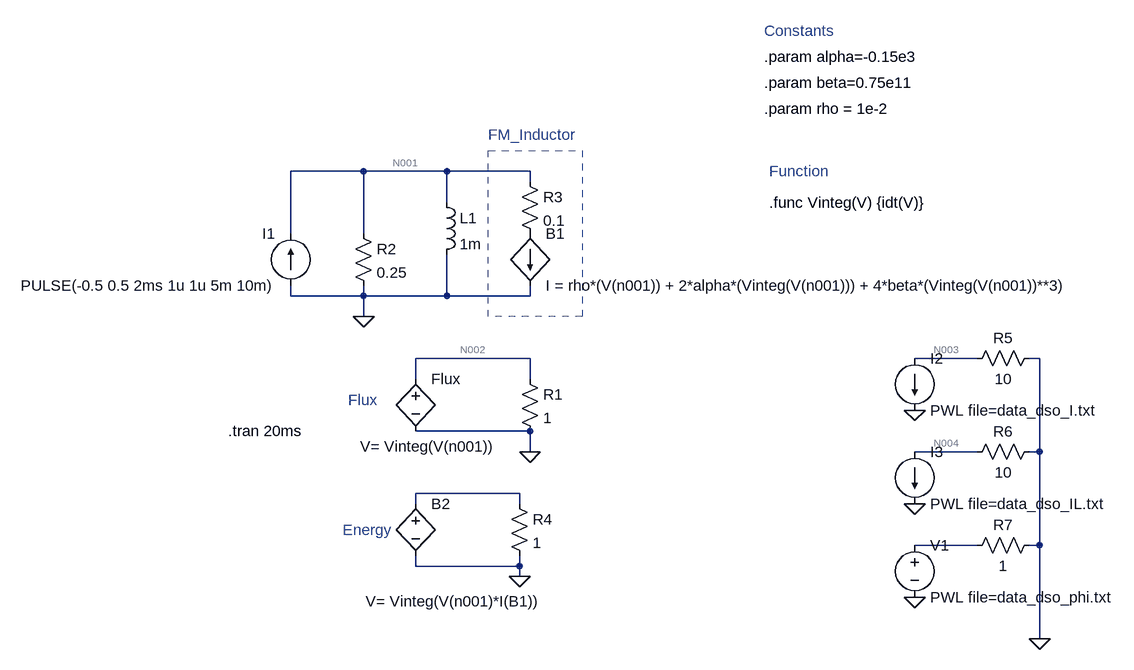
[diagram p0: schematic ferromag_ind_pos_ind.asc]
ferromag_ind_pos_ind.asc, the LTspice schematic file:
Version 4
SHEET 1 1992 692
WIRE 176 -48 64 -48
WIRE 304 -48 176 -48
WIRE 432 -48 304 -48
WIRE 432 -32 432 -48
WIRE 304 0 304 -48
WIRE 64 48 64 -48
WIRE 176 48 176 -48
WIRE 64 144 64 128
WIRE 176 144 176 128
WIRE 176 144 64 144
WIRE 304 144 304 80
WIRE 304 144 176 144
WIRE 432 144 432 128
WIRE 432 144 304 144
WIRE 176 176 176 144
WIRE 432 240 256 240
WIRE 1120 240 1024 240
WIRE 1216 240 1200 240
WIRE 256 272 256 240
WIRE 432 272 432 240
WIRE 432 352 256 352
WIRE 432 384 432 352
WIRE 1120 384 1024 384
WIRE 1216 384 1216 240
WIRE 1216 384 1200 384
WIRE 416 448 256 448
WIRE 256 464 256 448
WIRE 416 464 416 448
WIRE 1120 528 1024 528
WIRE 1216 528 1216 384
WIRE 1216 528 1200 528
WIRE 256 560 256 544
WIRE 416 560 416 544
WIRE 416 560 256 560
WIRE 416 576 416 560
WIRE 1216 672 1216 528
FLAG 176 176 0
FLAG 432 384 0
FLAG 416 576 0
FLAG 1216 672 0
FLAG 1024 608 0
FLAG 1024 464 0
FLAG 1024 320 0
SYMBOL bi 432 48 R0
SYMATTR InstName B1
SYMATTR Value I = rho*(V(n001)) + 2*alpha*(Vinteg(V(n001))) + 4*beta*(Vinteg(V(n001))**3)
SYMBOL current 64 128 R180
WINDOW 0 24 80 Left 2
WINDOW 3 24 0 Left 2
WINDOW 123 0 0 Left 0
WINDOW 39 0 0 Left 0
SYMATTR InstName I1
SYMATTR Value PULSE(-0.5 0.5 2ms 1u 1u 5m 10m)
SYMBOL res 160 32 R0
SYMATTR InstName R2
SYMATTR Value 0.25
SYMBOL res 416 -48 R0
SYMATTR InstName R3
SYMATTR Value 0.1
SYMBOL bv 256 256 R0
WINDOW 3 -85 120 Left 2
SYMATTR Value V= Vinteg(V(n001))
SYMATTR InstName Flux
SYMBOL res 416 256 R0
SYMATTR InstName R1
SYMATTR Value 1
SYMBOL bv 256 448 R0
WINDOW 3 -77 166 Left 2
SYMATTR Value V= Vinteg(V(n001)*I(B1))
SYMATTR InstName B2
SYMBOL res 400 448 R0
SYMATTR InstName R4
SYMATTR Value 1
SYMBOL current 1024 240 R0
WINDOW 123 0 0 Left 0
WINDOW 39 0 0 Left 0
SYMATTR InstName I2
SYMATTR Value PWL file=data_dso_I.txt
SYMBOL current 1024 384 R0
WINDOW 123 0 0 Left 0
WINDOW 39 0 0 Left 0
SYMATTR InstName I3
SYMATTR Value PWL file=data_dso_IL.txt
SYMBOL voltage 1024 512 R0
WINDOW 123 0 0 Left 0
WINDOW 39 0 0 Left 0
SYMATTR InstName V1
SYMATTR Value PWL file=data_dso_phi.txt
SYMBOL res 1216 224 R90
WINDOW 0 0 56 VBottom 2
WINDOW 3 32 56 VTop 2
SYMATTR InstName R5
SYMATTR Value 10
SYMBOL res 1216 368 R90
WINDOW 0 0 56 VBottom 2
WINDOW 3 32 56 VTop 2
SYMATTR InstName R6
SYMATTR Value 10
SYMBOL res 1216 512 R90
WINDOW 0 0 56 VBottom 2
WINDOW 3 32 56 VTop 2
SYMATTR InstName R7
SYMATTR Value 1
SYMBOL ind 288 -16 R0
SYMATTR InstName L1
SYMATTR Value 1m
TEXT 792 -224 Left 2 !.param alpha=-0.15e3
TEXT 792 -184 Left 2 !.param beta=0.75e11
TEXT 792 -144 Left 2 !.param rho = 1e-2
TEXT 800 0 Left 2 !.func Vinteg(V) {idt(V)}
TEXT -32 352 Left 2 !.tran 20ms
TEXT 368 -104 Left 2 ;FM_Inductor
TEXT 792 -264 Left 2 ;Constants
TEXT 800 -48 Left 2 ;Function
TEXT 152 304 Left 2 ;Flux
TEXT 144 504 Left 2 ;Energy
RECTANGLE Normal 512 176 368 -80 2

The netlist it stands for:
* ferromag_ind_pos_ind.asc
B1 P001 0 I = rho*(V(n001)) + 2*alpha*(Vinteg(V(n001))) + 4*beta*(Vinteg(V(n001))**3)
I1 0 N001 PULSE(-0.5 0.5 2ms 1u 1u 5m 10m)
R2 N001 0 0.25
R3 N001 P001 0.1
B§Flux N002 0 V= Vinteg(V(n001))
R1 N002 0 1
B2 N005 0 V= Vinteg(V(n001)*I(B1))
R4 N005 0 1
I2 N003 0 PWL file=data_dso_I.txt
I3 N004 0 PWL file=data_dso_IL.txt
V1 N006 0 PWL file=data_dso_phi.txt
R5 0 N003 10
R6 0 N004 10
R7 0 N006 1
L1 N001 0 1m
.param alpha=-0.15e3
.param beta=0.75e11
.param rho = 1e-2
.func Vinteg(V) {idt(V)}
.tran 20ms
* FM_Inductor
* Constants
* Function
* Flux
* Energy
.backanno
.end

* Results of the author's LTspice run, read from the files saved beside the schematic
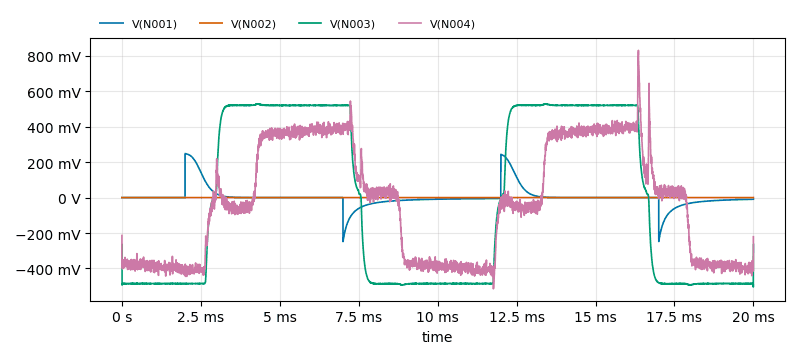
[diagram p1: Transient Analysis of ferromag_ind_pos_ind.asc, plotted from the saved traces]
* Transient Analysis, 1 run:
*   V(N001): min -248.8 mV, max 248.8 mV, average 1.469 mV, rms 58.17 mV, last -9.551 mV
*   V(N002): min -1.062 µV, max 144 µV, average 87.05 µV, rms 103.2 µV, last 29.37 µV
*   V(N003): min -508.8 mV, max 529.8 mV, average -24.86 mV, rms 481.1 mV, last -264.5 mV
*   V(N004): min -516.6 mV, max 831.2 mV, average -30.32 mV, rms 324.9 mV, last -221.1 mV